# Altium schematic sheet 02 BLOCK.SchDoc
size 420 x 297 mm
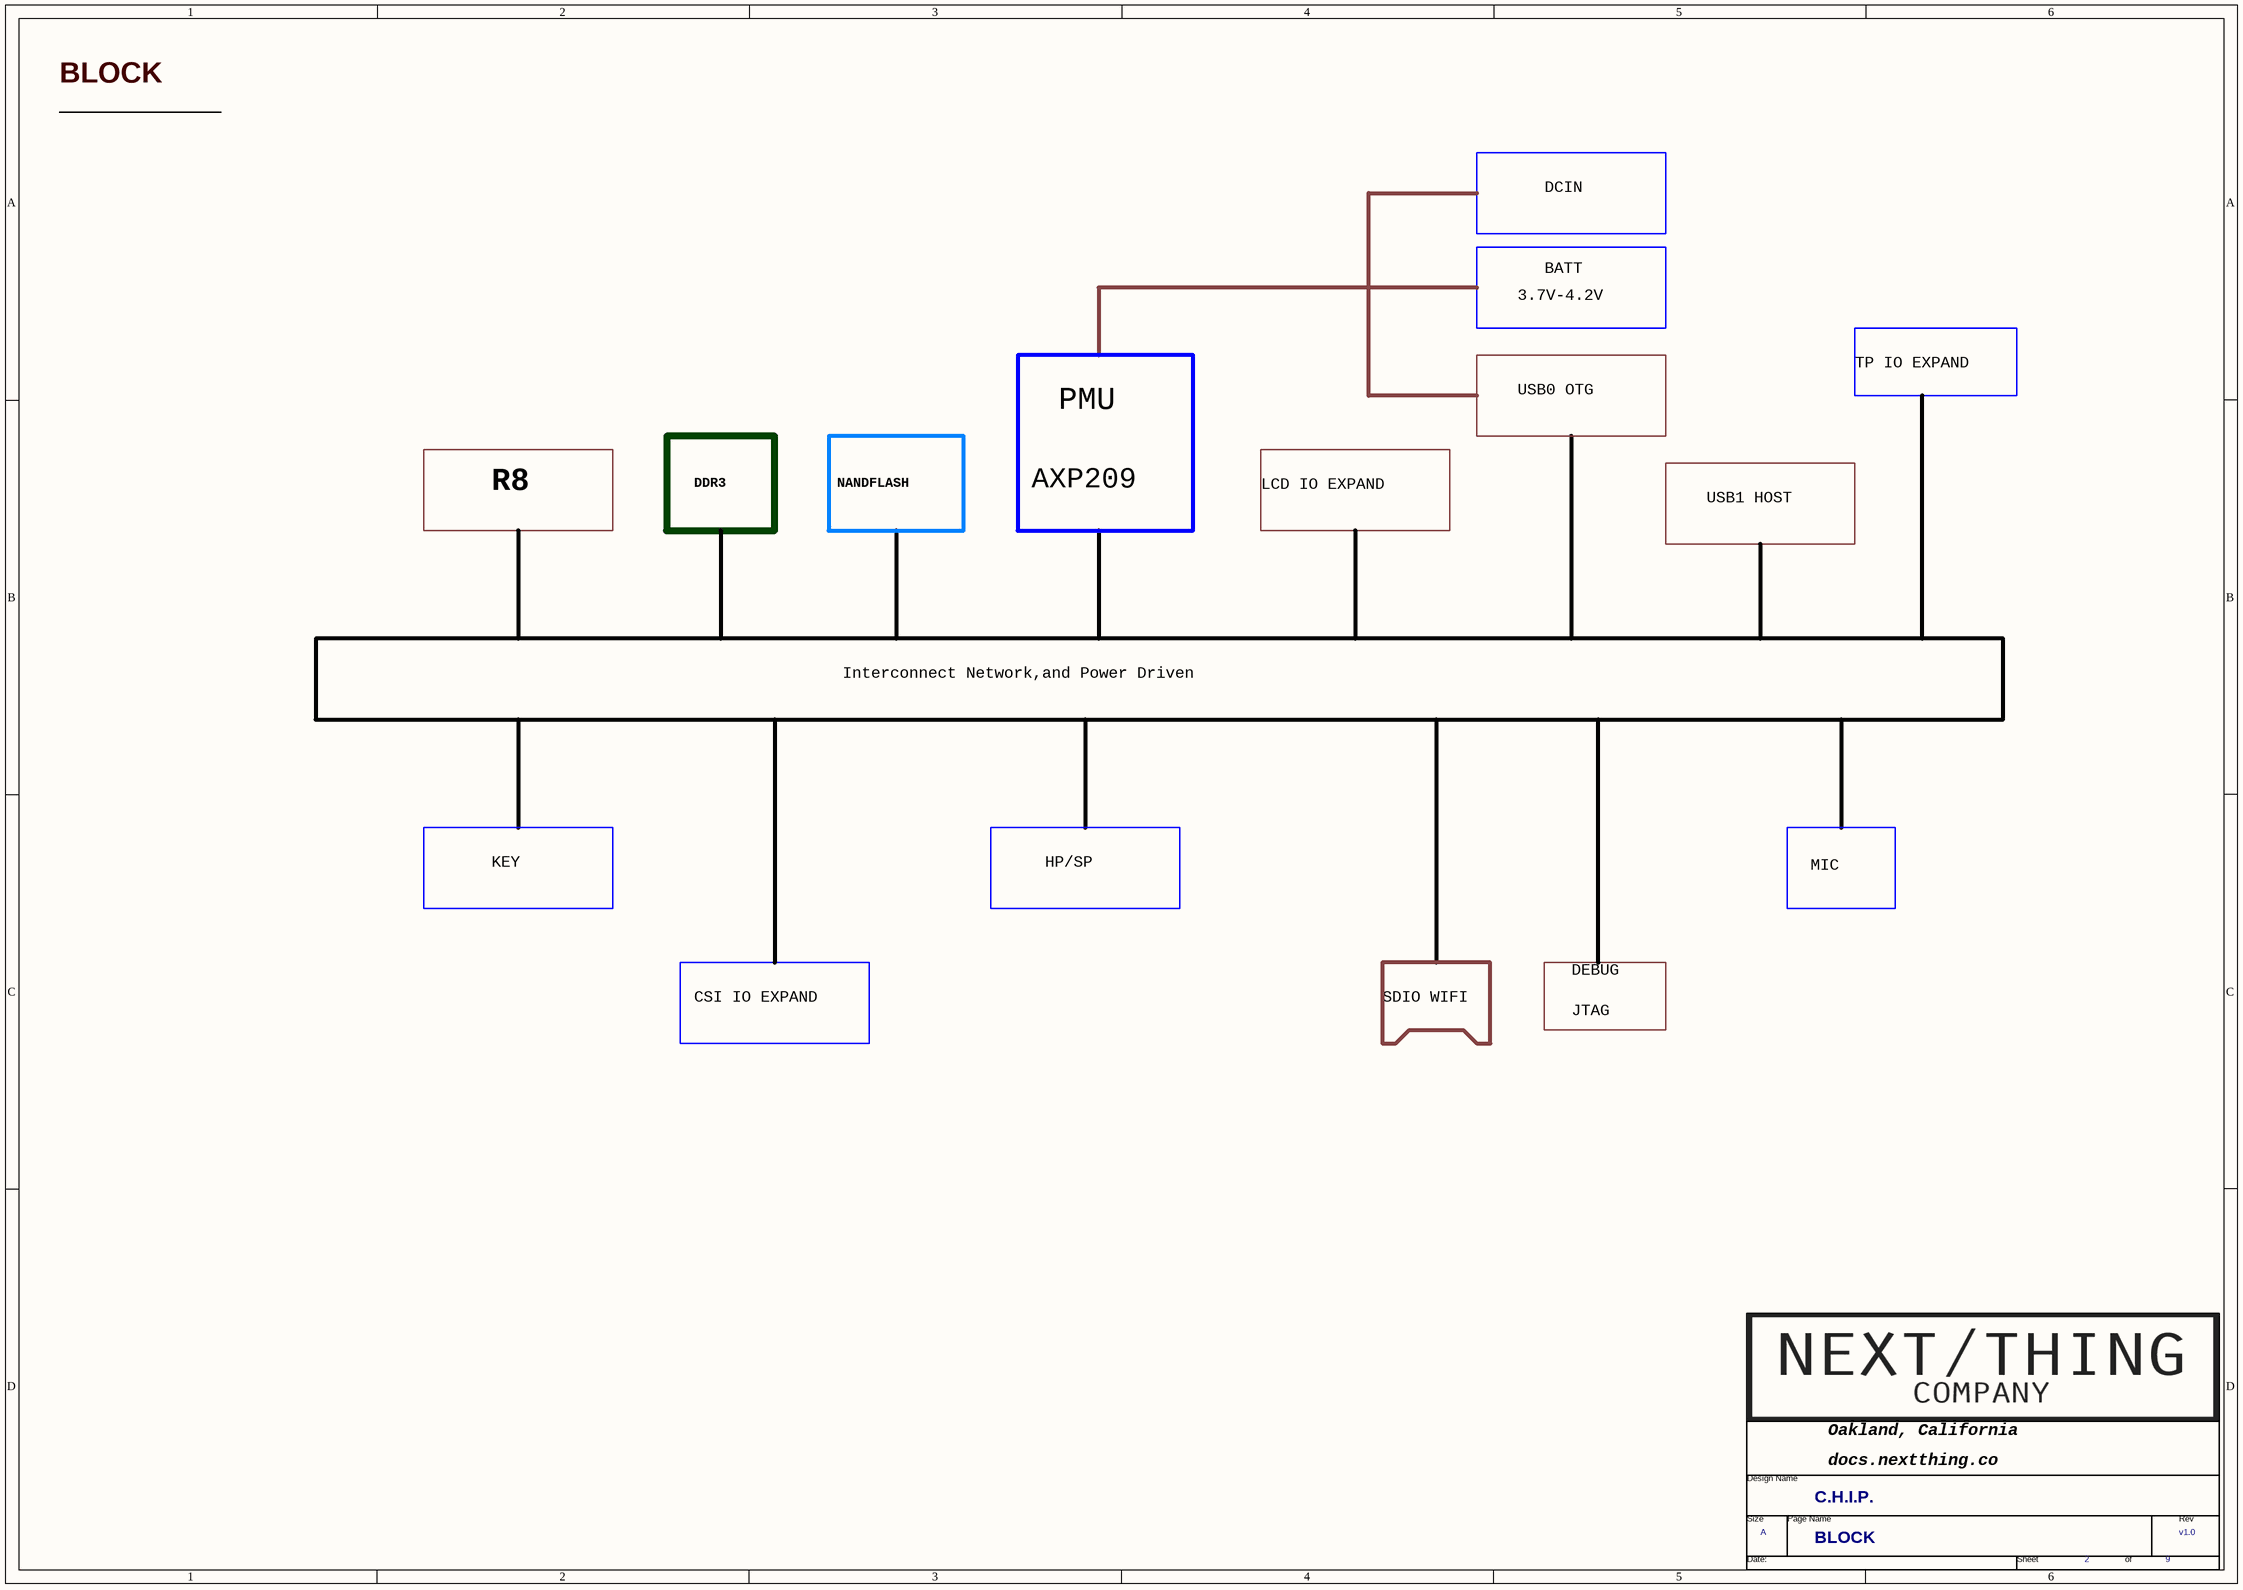
[diagram p0: 02 BLOCK.SchDoc]

## Parts
*  Page Count: 9  Page Number: 2  Page Size: A  Title: C.H.I.P.  RevCode: v1.0  Doc: BLOCK  (hidden comment: TitleBlock1-nextthing)  (graphical)

## Notes on the sheet
- BLOCK
- DCIN
- 3.7V-4.2V
- BATT
- USB0 OTG
- TP IO EXPAND
- PMU
- R8
- DDR3
- NANDFLASH
- AXP209
- LCD IO EXPAND
- USB1 HOST
- Interconnect Network,and Power Driven
- KEY
- HP/SP
- MIC
- CSI IO EXPAND
- SDIO WIFI
- DEBUG
- JTAG
- (in symbol TitleBlock1-nextthing) Oakland, California; Design Name; docs.nextthing.co /; Size; Page Name; Rev; Date:; Sheet; of

## Library data of the parts
* = TitleBlock1-nextthing: Page Create Date: March  8, 1995